# EasyEDA schematic Adapter-OBD_12V5VDCDC.json
TITLE: V2G OBD2 Adapter; REV: 0.8; Date: 2024-03-28; Sheet: 1/1; Drawn By: Jannis Hamborg; Company: Applied Cyber Security Darmstadt (hda)
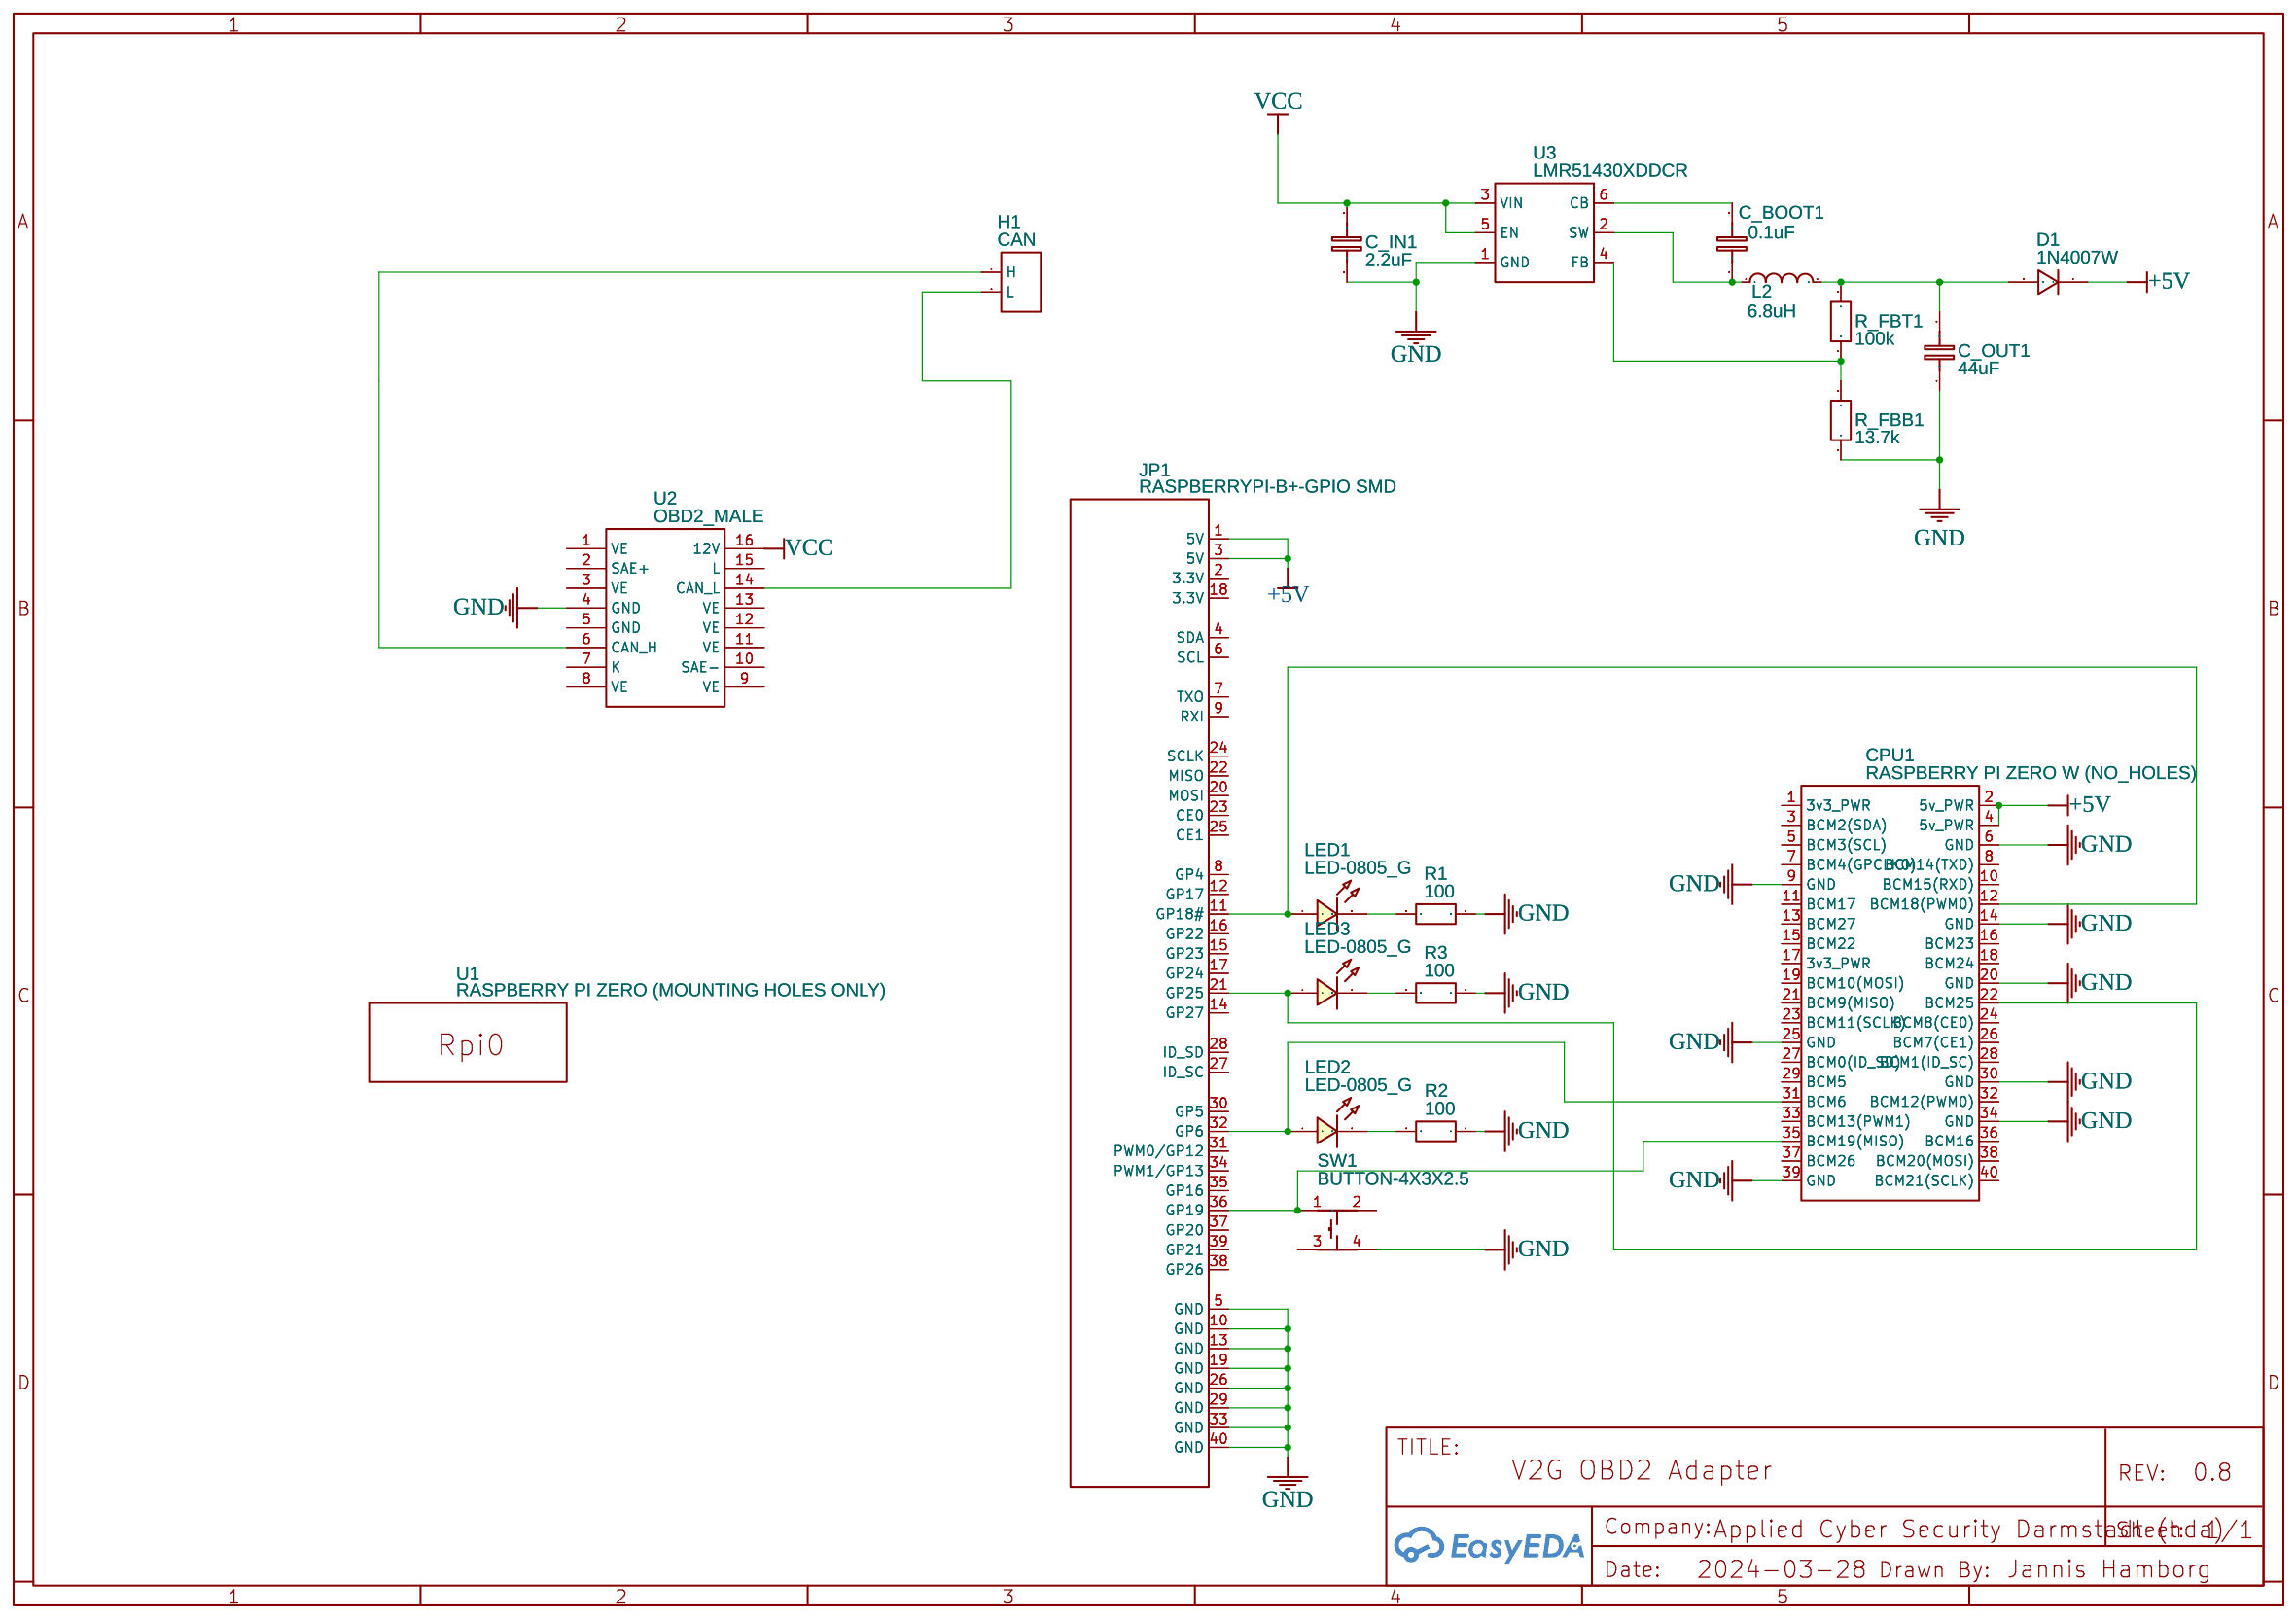
[diagram p0: schematic sheet]

## Parts
C_BOOT1  0.1uF  [C0805]
C_IN1  2.2uF  [C0805]
C_OUT1  44uF  [C0805]
CPU1  RASPBERRY PI ZERO W (NO_HOLES)  [RASPBERRY-PI-ZERO]
D1  1N4007W  [SOD-123_L2.8-W1.8-LS3.7-RD]
H1  CAN  [HDR-F-2.54_1X2]
JP1  RASPBERRYPI-B+-GPIO SMD  [PIN_HEADER_STRAIGHT_2X20_PITCH2.54MM_SMD]
L2  6.8uH  [IND-SMD_L2.3-W1.7]
LED1  LED-0805_G  [LED0805_GREEN]
LED2  LED-0805_G  [LED0805_GREEN]
LED3  LED-0805_G  [LED0805_GREEN]
R1  100  [R0805]
R2  100  [R0805]
R3  100  [R0805]
R_FBB1  13.7k  [R0805]
R_FBT1  100k  [R0805]
SW1  BUTTON-4X3X2.5  [SW-SMD_4P-L4.2-W3.2-P2.15-LS5.2]
U1  RASPBERRY PI ZERO (MOUNTING HOLES ONLY)  [RASPBERRY PI ZERO (MOUNTING HOLES)]
U2  OBD2_MALE  [OBD2_MALE]
U3  LMR51430XDDCR  [SOT-23-6_L2.9-W1.6-P0.95-LS2.8-BL]

## Library data of the parts
C_BOOT1 C_IN1 C_OUT1 = C_0805_EU: Contributor: LCEDA_Lib
CPU1 = RASPBERRY PI ZERO W (NO_HOLES): Manufacturer: Raspberry Pi; Manufacturer Part: Pi Zero W; Supplier: Adafruit; Supplier Part: 3400; link: https://www.adafruit.com/product/3400; Contributor: lordzurp
D1 = 1N4007W: Supplier: LCSC; Supplier Part: C328592; Manufacturer: BLUE ROCKET; Contributor: LCEDA_Lib
H1 = HDR-F-2.54_1x2: Supplier Part: C49661; Supplier: LCSC; Contributor: LCEDA_Lib
JP1 = RASPBERRYPI-B+-GPIO SMD: Raspberry Pi B+ GPIO Header; Contributor: toschoch; Manufacturer Part: 95157-440LF; Supplier: Digi-Key; Supplier Part: 609-3124-ND; Manufacturer: Amphenol ICC (FCI); link: https://cdn.amphenol-icc.com/media/wysiwyg/files/drawing/95157.pdf; Package Display: No
L2 = FHW0805UF6R8JST: Contributor: LCSC; Supplier: LCSC; Supplier Part: C393993; Manufacturer: FH(风华); JLCPCB Part Class: Extended Part
LED1-LED3 = LED-0805_G: Manufacturer: 国星光电; Manufacturer Part: NCD0805G1; Supplier Part: C84260; Contributor: LCEDA_Lib
R1-R3 = R_0805_EU: Contributor: LCEDA_Lib
R_FBB1 R_FBT1 = R_0603_EU: Contributor: LCEDA_Lib
SW1 = BUTTON-4X3X2.5: Contributor: lcsc; Supplier: LCSC; Supplier Part: C9900020294; Manufacturer: null; JLCPCB Part Class: Extended Part
U1 = RASPBERRY PI ZERO (MOUNTING HOLES ONLY): Manufacturer: Raspberry Pi Zero W; Manufacturer Part: Raspberry Pi Zero W; Contributor: Atulya John
U2 = OBD2_MALE: Contributor: Pallnita
U3 = LMR51430XDDCR: Contributor: lcsc; Supplier: LCSC; Supplier Part: C5185863; Manufacturer: null; JLCPCB Part Class: Extended Part

## Nets
+5V: CPU1.2(5v PWR) CPU1.4(5v PWR) D1.1 JP1.1(5V) JP1.3(5V)
GND: C_IN1.1 C_OUT1.1 CPU1.6(GND) CPU1.9(GND) CPU1.14(GND) CPU1.20(GND) CPU1.25(GND) CPU1.30(GND) CPU1.34(GND) CPU1.39(GND) JP1.5(GND) JP1.10(GND) JP1.13(GND) JP1.19(GND) JP1.26(GND) JP1.29(GND) JP1.33(GND) JP1.40(GND) R1.2 R2.1 R3.1 R_FBB1.1 SW1.4 U2.4(GND) U3.1(GND)
VCC: C_IN1.2 U2.16(12V) U3.3(VIN) U3.5(EN)
Net-(C_BOOT1-1): C_BOOT1.1 L2.1 U3.2(SW)
Net-(C_BOOT1-2): C_BOOT1.2 U3.6(CB)
Net-(C_OUT1-2): C_OUT1.2 D1.2 L2.2 R_FBT1.2
Net-(CPU1-12): CPU1.12(BCM18(PWM0)) JP1.11(GP18#) LED1.1
Net-(CPU1-22): CPU1.22(BCM25) JP1.21(GP25) LED3.1
Net-(CPU1-31): CPU1.31(BCM6) JP1.32(GP6) LED2.1
Net-(CPU1-35): CPU1.35(BCM19(MISO)) JP1.36(GP19) SW1.1
Net-(H1-1): H1.1(H) U2.6(CAN_H)
Net-(H1-2): H1.2(L) U2.14(CAN_L)
Net-(LED1-2): LED1.2 R1.1
Net-(LED2-2): LED2.2 R2.2
Net-(LED3-2): LED3.2 R3.2
Net-(R_FBB1-2): R_FBB1.2 R_FBT1.1 U3.4(FB)

Not connected (* = marked no-connect by the designer): CPU1 1(3v3 PWR) 3(BCM2(SDA)) 5(BCM3(SCL)) 7(BCM4(GPCLK0)) 8(BCM14(TXD)) 10(BCM15(RXD)) 11(BCM17) 13(BCM27) 15(BCM22) 16(BCM23) 17(3v3 PWR) 18(BCM24) 19(BCM10(MOSI)) 21(BCM9(MISO)) 23(BCM11(SCLK)) 24(BCM8(CE0)) 26(BCM7(CE1)) 27(BCM0(ID_SD)) 28(BCM1(ID_SC)) 29(BCM5) 32(BCM12(PWM0)) 33(BCM13(PWM1)) 36(BCM16) 37(BCM26) 38(BCM20(MOSI)) 40(BCM21(SCLK)); JP1 2(3.3V) 4(SDA) 6(SCL) 7(TXO) 8(GP4) 9(RXI) 12(GP17) 14(GP27) 15(GP23) 16(GP22) 17(GP24) 18(3.3V) 20(MOSI) 22(MISO) 23(CE0) 24(SCLK) 25(CE1) 27(ID_SC) 28(ID_SD) 30(GP5) 31(PWM0/GP12) 34(PWM1/GP13) 35(GP16) 37(GP20) 38(GP26) 39(GP21); SW1 2 3; U2 1(VE) 2(SAE+) 3(VE) 5(GND) 7(K) 8(VE) 9(VE) 10(SAE-) 11(VE) 12(VE) 13(VE) 15(L)
